# EAGLE design button_switch (EAGLE 6.3)
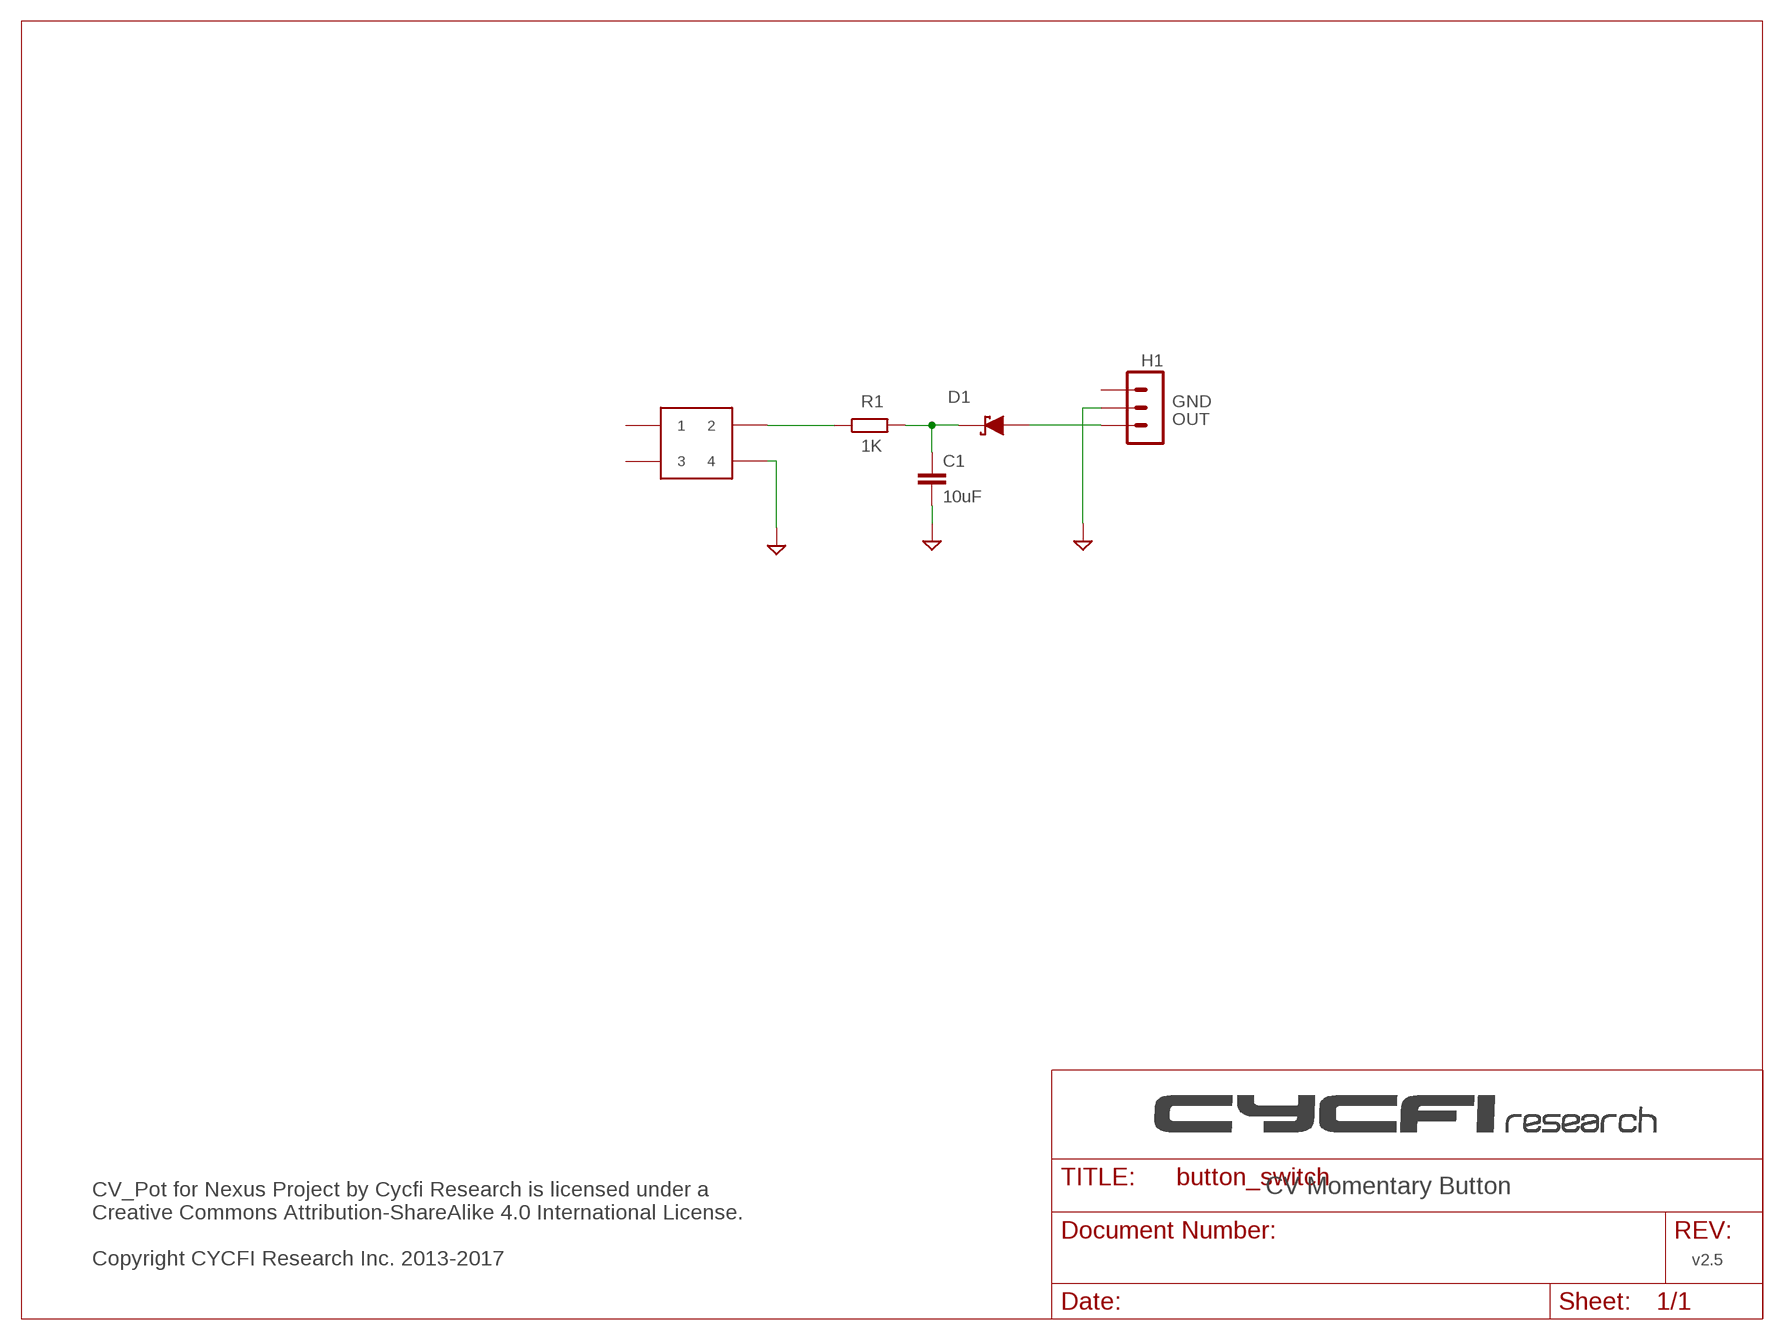
[diagram p0: schematic, sheet 1]

## Parts
C1  10uF  C-EUC0603  [C0603]
D1  D_SCHOTTKYL  [SOD-323]
H1  3PIN-SMD-2.54MM  [3P-SMD-2.54MM]
R1  1K  R-EU_R0402  [R0402]
U$1  TACT_6X6_SMD  [TACT_6X6_SMD]

## Nets
GND: C1.2 H1.P$2 U$1.P$4
N$1: C1.1 D1.2(C) R1.2
N$2: R1.1 U$1.P$2
SW2: D1.1(A) H1.P$1
Unconnected: H1.P$3 U$1.P$1 U$1.P$3

## Notes on the sheet
- GND
- OUT
- CV Momentary Button
- CV_Pot for Nexus Project by Cycfi Research is licensed under a 
  Creative Commons Attribution-ShareAlike 4.0 International License. 
  
  Copyright CYCFI Research Inc. 2013-2017
- v2.5

## Library data of the parts
C1 = resistor:C-EU: CAPACITOR, European symbol
D1 = m-pad-2.1:D_SCHOTTKY: Schottky diodes in various packages
H1 = CYCFI_Con:3PIN-SMD-2.54MM
R1 = resistor:R-EU_: RESISTOR, European symbol
U$1 = CYCFI_switch:TACT_6X6_SMD

## Board
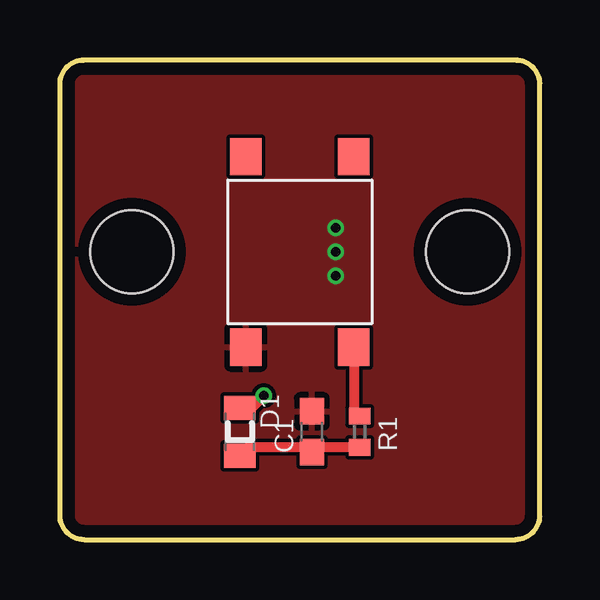
[diagram p1: board, top side]
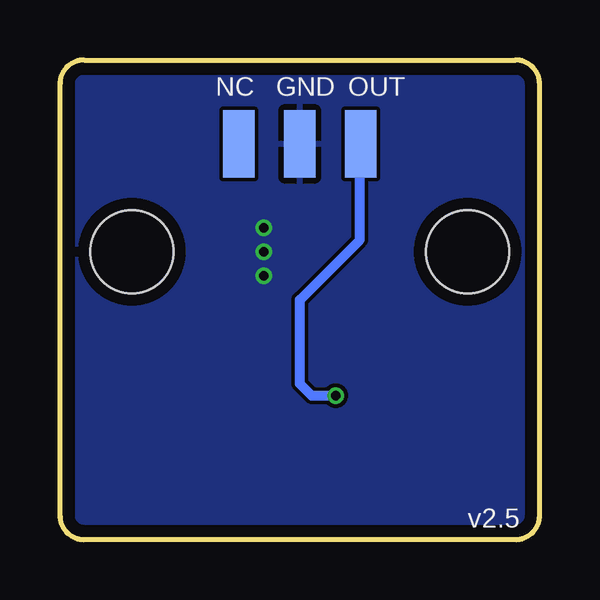
[diagram p2: board, bottom side, seen from below]

Size 20 x 20 mm. Coordinates in mm from the lower left corner, seen from the top.
Outline: 0,1 0,19 arc-90 1,20 19,20 arc-90 20,19 20,1 arc-90 19,0 1,0 arc-90 0,1
Copper layers (1*16): Top 0.035mm / dielectric 1.6mm / Bottom 0.035mm
Design rules "Elecrow_2-layer_PCB_eagle_rule": minimum track width 6mil, minimum drill 12mil, track to track 6mil, track to pad 8mil, pad to pad 12mil, via to via 12mil, smd to smd 0mil, copper to edge 20mil, drill to drill 10mil, minimum pad ring 6mil, minimum via ring 6mil, stop-mask expansion 0mil, vias tented up to drill 100mil, thermal gap 10mil
Holes 3.45 mm at 3,12 17,12

### Footprints (pad centres in the part's own frame; a part is rotated, then mirrored left to right if it is on the bottom)
C0603 = smd 1.1 x 1: 1 -0.85,0; 2 0.85,0
SOD-323 = smd 1 x 1.3: 1 -1,0; 2 1,0
3P-SMD-2.54MM = smd 1.3 x 2.8: P$1 -2.54,0; P$2 0,0; P$3 2.54,0
R0402 = smd 0.7 x 0.9: 1 -0.65,0; 2 0.65,0
TACT_6X6_SMD = smd 1.55 x 1.3: P$1 -3.975,2.25; P$2 3.975,2.25; P$3 -3.975,-2.25; P$4 3.975,-2.25

### Placement (x,y rotation side)
C1  10.5,4.5 90 top
D1  7.5,4.5 270 top
H1  10,16.5 180 bottom
R1  12.5,4.5 270 top
U$1  10,12 270 top

### Tracks (layer width: path | path; a pad name or v marks a point on that pad's centre or on a via)
GND  (via drill 0.4)
  other vias: 11.5,13 11.5,12 11.5,11
  pour Top: 0,20 0,0 20,0 20,20
  pour Bottom: 0,0 20,0 20,20 0,20
N$1
  Top 0.406: C1.1 10.7,3.85 R1.2 7.85,3.85 D1.2
N$2
  Top 0.406: U$1.P$2 12.25,5.4 R1.1
SW2  (via drill 0.4)
  Top 0.406: D1.1 8,5.5 v8.5,6
  Bottom 0.406: v8.5,6 9.5,6 10,6.5 10,10 7.5,12.5 7.5,16.46 H1.P$1

### Text on the board
bNames: OUT | GND | NC | v2.5